# Altium project IOT Board.PrjPcb
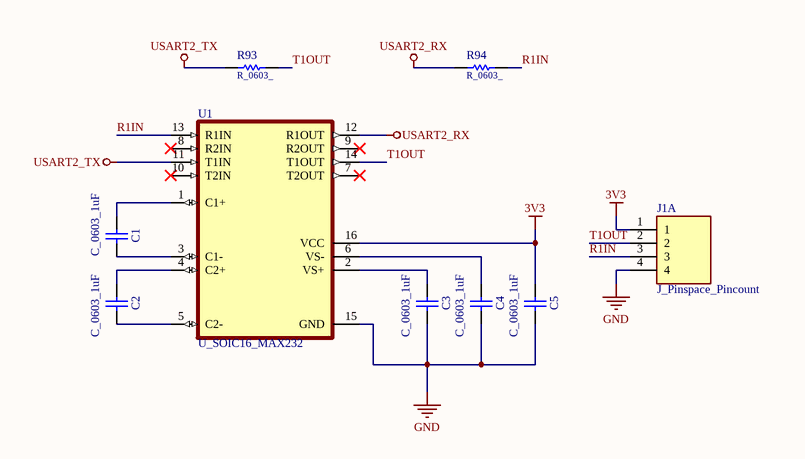
[diagram p0: Com.SchDoc]
7 sheets, 247 parts. Net scope: global (net labels, ports and power ports of the same name join across sheets).
Board file: IOT Board.PcbDoc
Sheets:
  Com.SchDoc
  ESP.SchDoc
  GSM.SchDoc
  MCU.SchDoc
  Motor.SchDoc
  Power.SchDoc
  Sensor.SchDoc

## Sheet Com.SchDoc
size A

### Parts
C1  C_0603_1uF  [CAP 0603]
C2  C_0603_1uF  [CAP 0603]
C3  C_0603_1uF  [CAP 0603]
C4  C_0603_1uF  [CAP 0603]
C5  C_0603_1uF  [CAP 0603]
J1  J_Pinspace_Pincount  [4 Pin PCB TB 3.81]  (part A of 2)
R93  R_0603_  [RES 0603]
R94  R_0603_  [RES 0603]
U1  U_SOIC16_MAX232  [SOIC16]

### Nets
3V3: C5.2 J1.1 U1.16(VCC)
GND: C3.1 C4.1 C5.1 J1.4 U1.15(GND)
USART2_RX: R94.2 U1.12(R1OUT)
USART2_TX: R93.2 U1.11(T1IN)
R1IN: J1.3 R94.1 U1.13(R1IN)
T1OUT: J1.2 R93.1 U1.14(T1OUT)
NetC1_1: C1.1 U1.3(C1-)
NetC1_2: C1.2 U1.1(C1+)
NetC2_1: C2.1 U1.5(C2-)
NetC2_2: C2.2 U1.4(C2+)
NetC3_2: C3.2 U1.2(VS+)
NetC4_2: C4.2 U1.6(VS-)

Not connected (* = marked no-connect by the designer): U1 7(T2OUT)* 8(R2IN)* 9(R2OUT)* 10(T2IN)*

### Library data of the parts
C1-C5 = Cap: Capacitor; Published: 8-Jun-2000; LatestRevisionDate: 17-Jul-2002; LatestRevisionNote: Re-released for DXP Platform.; Publisher: Altium Limited
J1 = 4 Pin PCB Terminal Block: MP: TBP02R1-381-04BE; Availability: Unavailable; Package: None; Price: None; Value: *
R93 R94 = Res: Resistor; Published: 8-Jun-2000; LatestRevisionDate: 17-Jul-2002; LatestRevisionNote: Re-released for DXP Platform.; Publisher: Altium Limited
U1 = MAX232DW: Dual EIA-232 driver and receiver 16-SOIC 0 to 70; MF: Texas Instruments; Price: None; SnapEDA_Link: https://www.snapeda.com/parts/MAX232DW/Texas%20Instruments/view-part/7702/?ref=snap; Purchase-URL: https://pricing.snapeda.com/search/part/MAX232DW/?ref=eda; Check_prices: https://www.snapeda.com/parts/MAX232DW/Texas%20Instruments/view-part/7702/?ref=eda; Value: *; MP: MAX232DW; Package: SOIC-16 Texas Instruments; Availability: Good

## Sheet ESP.SchDoc
size A
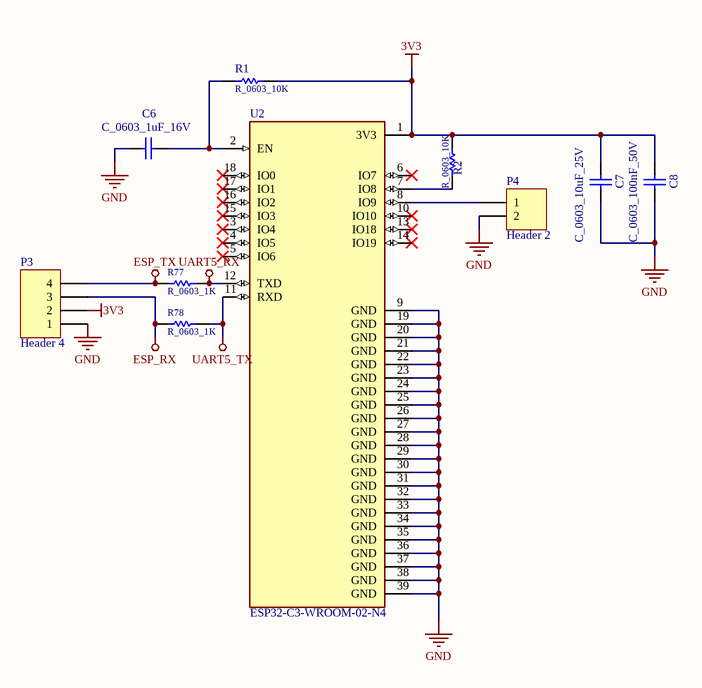
[diagram p1: ESP.SchDoc]

### Parts
C6  C_0603_1uF_16V  [CAP 0603]
C7  C_0603_10uF_25V  [CAP 0603]
C8  C_0603_100nF_50V  [CAP 0603]
P3  Header 4  [HDR1X4]
P4  Header 2  [HDR1X2]
R1  R_0603_10K  [RES 0603]
R2  R_0603_10K  [RES 0603]
R77  R_0603_1K  [RES 0603]
R78  R_0603_1K  [RES 0603]
U2  ESP32-C3-WROOM-02-N4  [ESP32-C3-WROOM-02-H4]

### Nets
3V3: C7.2 C8.2 P3.2 R1.1 R2.1 U2.1(3V3)
ESP_RX: P3.3 R78.2
ESP_TX: P3.4 R77.2
GND: C6.2 C7.1 C8.1 P3.1 P4.2 U2.9(GND) U2.19(GND) U2.20(GND) U2.21(GND) U2.22(GND) U2.23(GND) U2.24(GND) U2.25(GND) U2.26(GND) U2.27(GND) U2.28(GND) U2.29(GND) U2.30(GND) U2.31(GND) U2.32(GND) U2.33(GND) U2.34(GND) U2.35(GND) U2.36(GND) U2.37(GND) U2.38(GND) U2.39(GND)
UART5_RX: R77.1 U2.12(TXD)
UART5_TX: R78.1 U2.11(RXD)
NetC6_1: C6.1 R1.2 U2.2(EN)
NetP4_1: P4.1 U2.8(IO9)
NetR2_2: R2.2 U2.7(IO8)

Not connected (* = marked no-connect by the designer): U2 3(IO4)* 4(IO5)* 5(IO6)* 6(IO7)* 10(IO10)* 13(IO18)* 14(IO19)* 15(IO3)* 16(IO2)* 17(IO1)* 18(IO0)*

### Library data of the parts
C6-C8 = Cap: Capacitor; Published: 8-Jun-2000; LatestRevisionDate: 17-Jul-2002; LatestRevisionNote: Re-released for DXP Platform.; Publisher: Altium Limited
P3 = Header 4: Header, 4-Pin; LatestRevisionDate: 17-Jul-2002; LatestRevisionNote: Re-released for DXP Platform.; Publisher: Altium Limited
P4 = Header 2: Header, 2-Pin; LatestRevisionDate: 17-Jul-2002; LatestRevisionNote: Re-released for DXP Platform.; Publisher: Altium Limited
R1 R2 R77 R78 = Res: Resistor; Published: 8-Jun-2000; LatestRevisionDate: 17-Jul-2002; LatestRevisionNote: Re-released for DXP Platform.; Publisher: Altium Limited
U2 = ESP32-C3-WROOM-02-N4: WiFi Modules (802.11) (Engineering Samples) SMD module, ESP32-C3, 4MB SPI flash, PCB antenna, -40 C +85 C; MF: Espressif Systems; Value: *; SnapEDA_Link: https://www.snapeda.com/parts/ESP32-C3-WROOM-02-N4/Espressif+Systems/view-part/?ref=snap; Purchase-URL: https://pricing.snapeda.com/search/part/ESP32-C3-WROOM-02-N4/?ref=eda; Availability: In Stock; Price: None; Package: Package; Check_prices: https://www.snapeda.com/parts/ESP32-C3-WROOM-02-N4/Espressif+Systems/view-part/?ref=eda; MP: ESP32-C3-WROOM-02-N4

## Sheet GSM.SchDoc
size A3
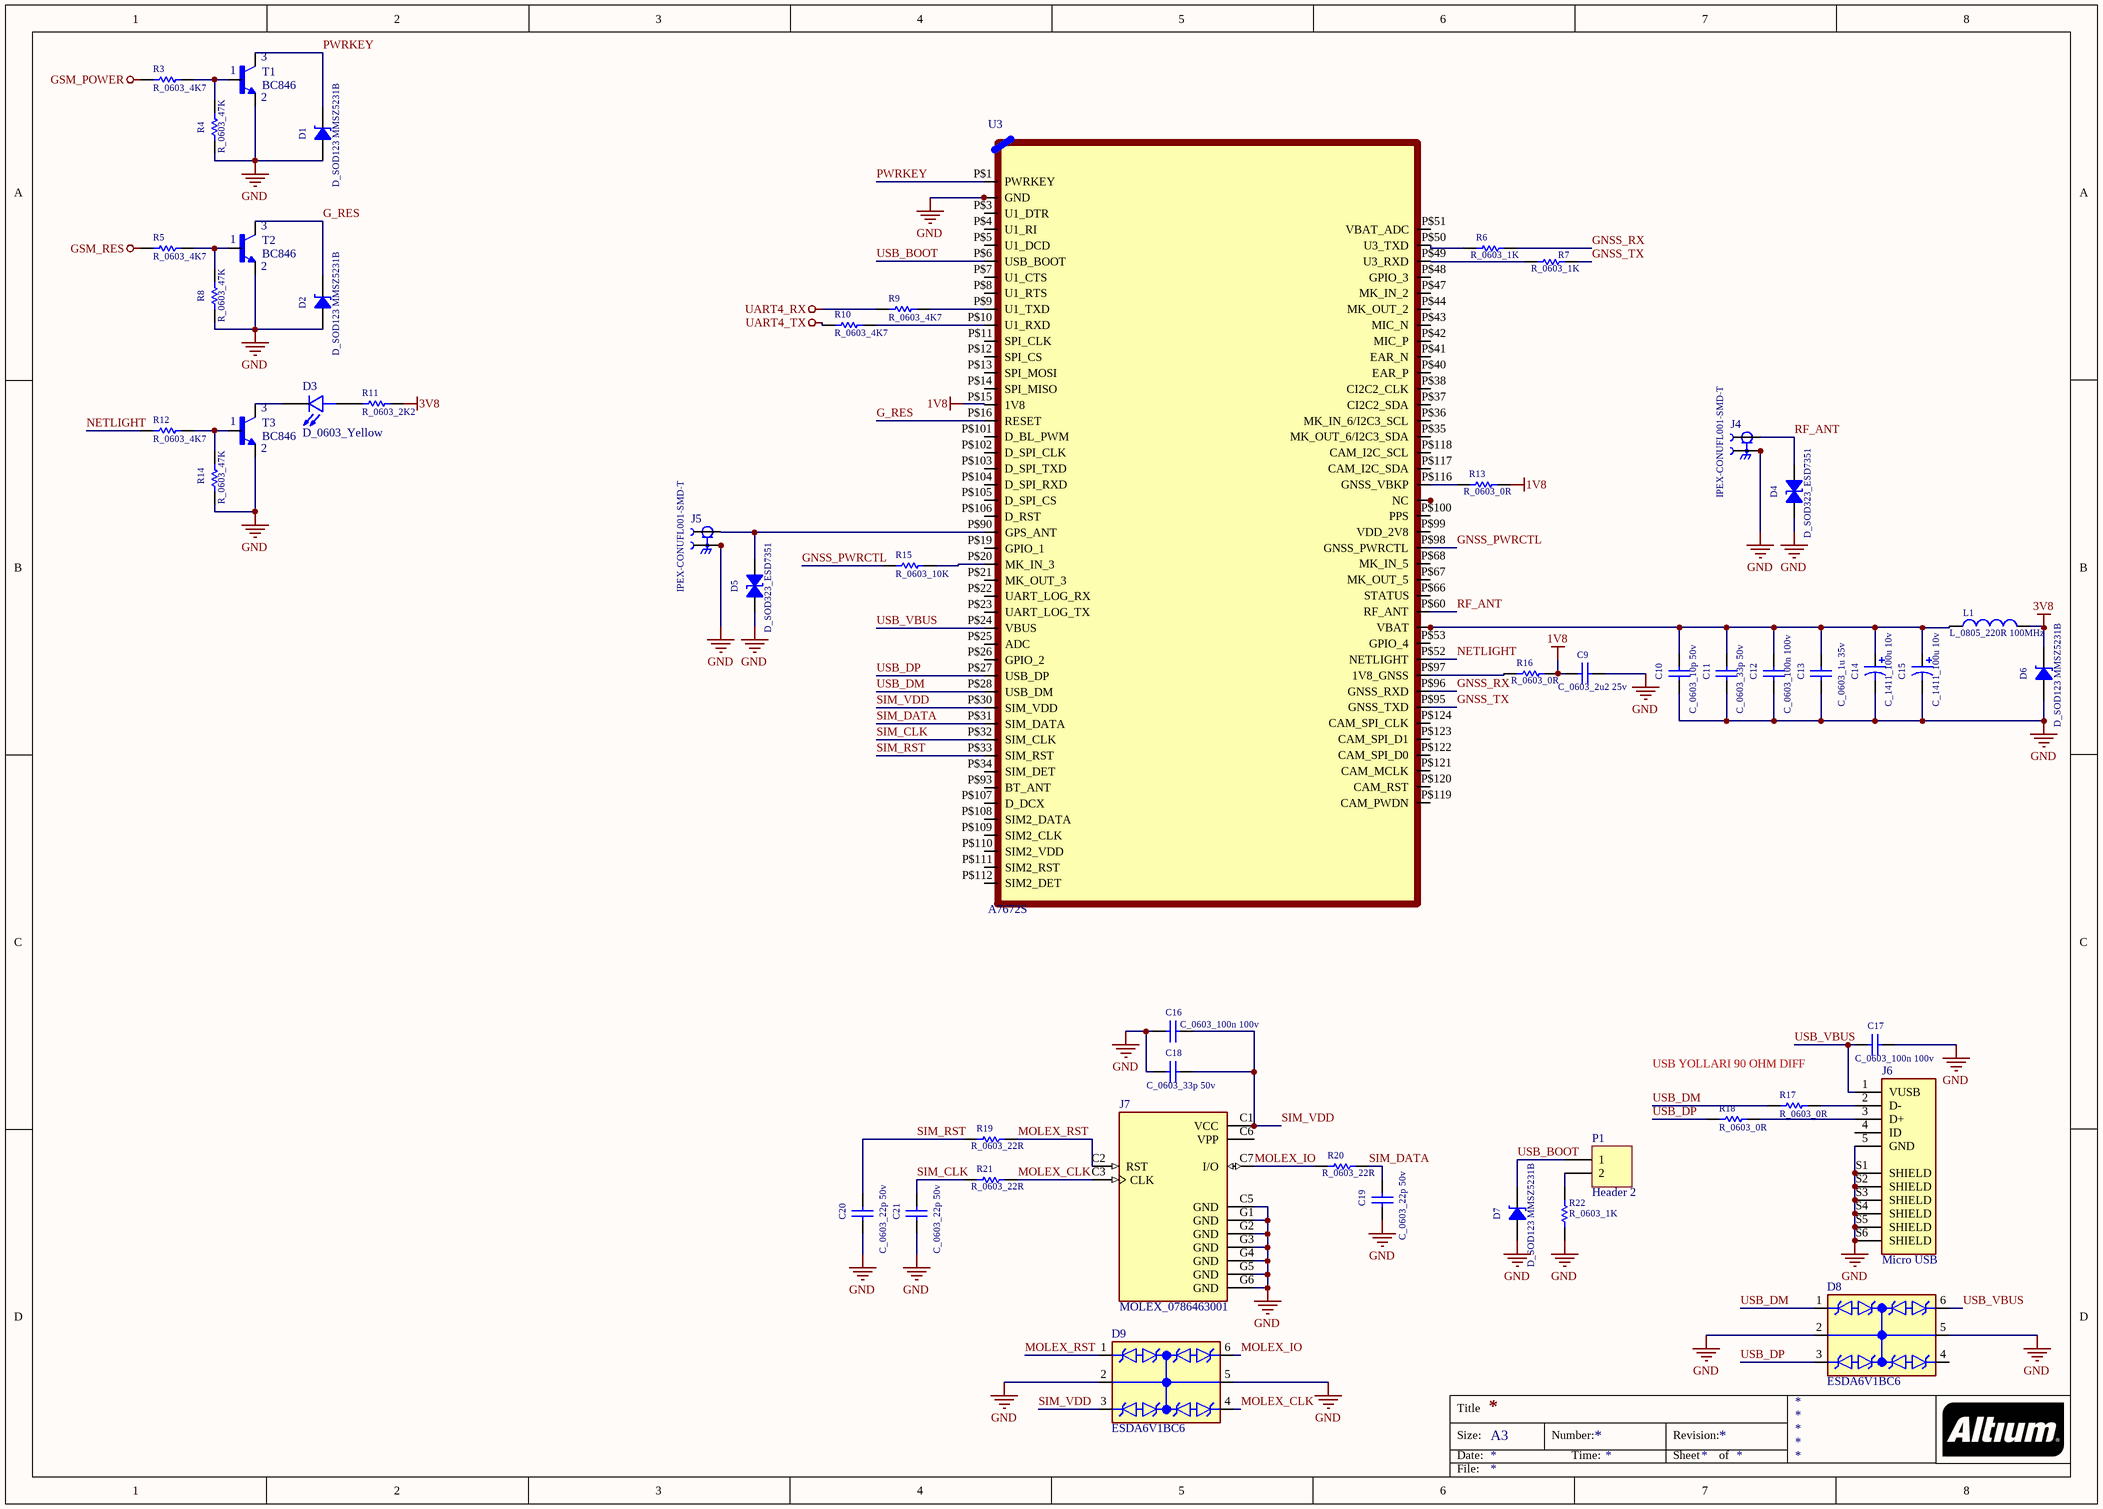
[diagram p2: GSM.SchDoc]

### Parts
C9  C_0603_2u2 25v  [CAP 0603]
C10  C_0603_10p 50v  [CAP 0603]
C11  C_0603_33p 50v  [CAP 0603]
C12  C_0603_100n 100v  [CAP 0603]
C13  C_0603_1u 35v  [CAP 0603]
C14  C_1411_100u 10v  [CAP 1411 TAN]
C15  C_1411_100u 10v  [CAP 1411 TAN]
C16  C_0603_100n 100v  [CAP 0603]
C17  C_0603_100n 100v  [CAP 0603]
C18  C_0603_33p 50v  [CAP 0603]
C19  C_0603_22p 50v  [CAP 0603]
C20  C_0603_22p 50v  [CAP 0603]
C21  C_0603_22p 50v  [CAP 0603]
D1  D_SOD123 MMSZ5231B  [SOD-123]
D2  D_SOD123 MMSZ5231B  [SOD-123]
D3  D_0603_Yellow  [Led 0603]
D4  D_SOD323_ESD7351  [SOD323]
D5  D_SOD323_ESD7351  [SOD323]
D6  D_SOD123 MMSZ5231B  [SOD-123]
D7  D_SOD123 MMSZ5231B  [SOD-123]
D8  ESDA6V1BC6  [SOT23-6]
D9  ESDA6V1BC6  [SOT23-6]
J4  IPEX-CONUFL001-SMD-T  [IPEX_LINX_CONUFL001-SMD-T]
J5  IPEX-CONUFL001-SMD-T  [IPEX_LINX_CONUFL001-SMD-T]
J6  Micro USB  [Micro USB]
J7  MOLEX_0786463001  [MOLEX_0786463001]
L1  L_0805_220R 100MHz  [Inductor 0805]
P1  Header 2  [HDR1X2]
R3  R_0603_4K7  [RES 0603]
R4  R_0603_47K  [RES 0603]
R5  R_0603_4K7  [RES 0603]
R6  R_0603_1K  [RES 0603]
R7  R_0603_1K  [RES 0603]
R8  R_0603_47K  [RES 0603]
R9  R_0603_4K7  [RES 0603]
R10  R_0603_4K7  [RES 0603]
R11  R_0603_2K2  [RES 0603]
R12  R_0603_4K7  [RES 0603]
R13  R_0603_0R  [RES 0603]
R14  R_0603_47K  [RES 0603]
R15  R_0603_10K  [RES 0603]
R16  R_0603_0R  [RES 0603]
R17  R_0603_0R  [RES 0603]
R18  R_0603_0R  [RES 0603]
R19  R_0603_22R  [RES 0603]
R20  R_0603_22R  [RES 0603]
R21  R_0603_22R  [RES 0603]
R22  R_0603_1K  [RES 0603]
T1  BC846  [SOT23]
T2  BC846  [SOT23]
T3  BC846  [SOT23]
U3  A7672S  [A7672S]

### Nets
1V8: C9.1 R13.1 R16.1 U3.P$15(1V8)
3V8: D6.2 L1.2 R11.2
GND: C9.2 C10.1 C11.1 C12.1 C13.2 C14.2 C15.2 C16.2 C17.1 C18.2 C19.2 C20.2 C21.2 D1.1 D2.1 D4.1 D5.1 D6.1 D7.1 D8.2(CC1) D8.5(CC2) D9.2(CC1) D9.5(CC2) J4.2 J4.3 J5.2 J5.3 J6.5(GND) J6.S1(SHIELD) J6.S2(SHIELD) J6.S3(SHIELD) J6.S4(SHIELD) J6.S5(SHIELD) J6.S6(SHIELD) J7.C5(GND) J7.G1(GND) J7.G2(GND) J7.G3(GND) J7.G4(GND) J7.G5(GND) J7.G6(GND) R4.2 R8.2 R14.2 R22.2 T1.2(E) T2.2(E) T3.2(E) U3.P$2(GND) U3.P$17(GND) U3.P$18(GND) U3.P$29(GND) U3.P$39(GND) U3.P$45(GND) U3.P$46(GND) U3.P$54(GND) U3.P$58(GND) U3.P$59(GND) U3.P$61(GND) U3.P$62(GND) U3.P$63(GND) U3.P$64(GND) U3.P$65(GND) U3.P$69(GND) U3.P$70(GND) U3.P$71(GND) U3.P$72(GND) U3.P$73(GND) U3.P$74(GND) U3.P$75(GND) U3.P$76(GND) U3.P$77(GND) U3.P$78(GND) U3.P$79(GND) U3.P$80(GND) U3.P$81(GND) U3.P$82(GND) U3.P$83(GND) U3.P$84(GND) U3.P$85(GND) U3.P$86(GND) U3.P$87(GND) U3.P$88(GND) U3.P$89(GND) U3.P$91(GND) U3.P$92(GND) U3.P$94(GND)
GSM_POWER: R3.2
GSM_RES: R5.2
UART4_RX: R9.2
UART4_TX: R10.2
G_RES: D2.2 T2.3(C) U3.P$16(RESET)
GNSS_PWRCTL: R15.2 U3.P$98(GNSS_PWRCTL)
GNSS_RX: R6.1 U3.P$96(GNSS_RXD)
GNSS_TX: R7.1 U3.P$95(GNSS_TXD)
MOLEX_CLK: D9.4(C3) J7.C3(CLK) R21.1
MOLEX_IO: D9.6(C4) J7.C7(I/O) R20.2
MOLEX_RST: D9.1(C1) J7.C2(RST) R19.1
NETLIGHT: R12.2 U3.P$52(NETLIGHT)
PWRKEY: D1.2 T1.3(C) U3.P$1(PWRKEY)
RF_ANT: D4.2 J4.1 U3.P$60(RF_ANT)
SIM_CLK: C21.1 R21.2 U3.P$32(SIM_CLK)
SIM_DATA: C19.1 R20.1 U3.P$31(SIM_DATA)
SIM_RST: C20.1 R19.2 U3.P$33(SIM_RST)
SIM_VDD: C16.1 C18.1 D9.3(C2) J7.C1(VCC) U3.P$30(SIM_VDD)
USB_BOOT: D7.2 P1.1 U3.P$6(USB_BOOT)
USB_DM: D8.1(C1) R17.2 U3.P$28(USB_DM)
USB_DP: D8.3(C2) R18.2 U3.P$27(USB_DP)
USB_VBUS: C17.2 D8.6(C4) J6.1(VUSB) U3.P$24(VBUS)
NetC10_2: C10.2 C11.2 C12.2 C13.1 C14.1 C15.1 L1.1 U3.P$55(VBAT) U3.P$56(VBAT) U3.P$57(VBAT)
NetD3_1: D3.1(A) R11.1
NetD3_2: D3.2(C) T3.3(C)
NetD5_2: D5.2 J5.1 U3.P$90(GPS_ANT)
NetJ6_2: J6.2(D-) R17.1
NetJ6_3: J6.3(D+) R18.1
NetP1_2: P1.2 R22.1
NetR3_1: R3.1 R4.1 T1.1(B)
NetR5_1: R5.1 R8.1 T2.1(B)
NetR6_2: R6.2 U3.P$50(U3_TXD)
NetR7_2: R7.2 U3.P$49(U3_RXD)
NetR9_1: R9.1 U3.P$9(U1_TXD)
NetR10_1: R10.1 U3.P$10(U1_RXD)
NetR12_1: R12.1 R14.1 T3.1(B)
NetR13_2: R13.2 U3.P$116(GNSS_VBKP)
NetR15_1: R15.1 U3.P$20(MK_IN_3)
NetR16_2: R16.2 U3.P$97(1V8_GNSS)
NetU3_P$113: U3.P$113(NC) U3.P$114(NC) U3.P$115(NC)

Not connected (* = marked no-connect by the designer): D8 4(C3); J6 4(ID); J7 C6(VPP); U3 P$3(U1_DTR) P$4(U1_RI) P$5(U1_DCD) P$7(U1_CTS) P$8(U1_RTS) P$11(SPI_CLK) P$12(SPI_CS) P$13(SPI_MOSI) P$14(SPI_MISO) P$19(GPIO_1) P$21(MK_OUT_3) P$22(UART_LOG_RX) P$23(UART_LOG_TX) P$25(ADC) P$26(GPIO_2) P$34(SIM_DET) P$35(MK_OUT_6/I2C3_SDA) P$36(MK_IN_6/I2C3_SCL) P$37(CI2C2_SDA) P$38(CI2C2_CLK) P$40(EAR_P) P$41(EAR_N) P$42(MIC_P) P$43(MIC_N) P$44(MK_OUT_2) P$47(MK_IN_2) P$48(GPIO_3) P$51(VBAT_ADC) P$53(GPIO_4) P$66(STATUS) P$67(MK_OUT_5) P$68(MK_IN_5) P$93(BT_ANT) P$99(VDD_2V8) P$100(PPS) P$101(D_BL_PWM) P$102(D_SPI_CLK) P$103(D_SPI_TXD) P$104(D_SPI_RXD) P$105(D_SPI_CS) P$106(D_RST) P$107(D_DCX) P$108(SIM2_DATA) P$109(SIM2_CLK) P$110(SIM2_VDD) P$111(SIM2_RST) P$112(SIM2_DET) P$117(CAM_I2C_SDA) P$118(CAM_I2C_SCL) P$119(CAM_PWDN) P$120(CAM_RST) P$121(CAM_MCLK) P$122(CAM_SPI_D0) P$123(CAM_SPI_D1) P$124(CAM_SPI_CLK)

### Notes on the sheet
- USB YOLLARI 90 OHM DIFF
- Title
- Size:
- Date:
- A3
- Number:
- Time:
- Revision:
- Sheet
- of
- File:

### Library data of the parts
C9-C13 C16-C21 = Cap: Capacitor; Published: 8-Jun-2000; LatestRevisionDate: 17-Jul-2002; LatestRevisionNote: Re-released for DXP Platform.; Publisher: Altium Limited
C14 C15 = Cap Tantalium: Capacitor Tantalium; Published: 8-Jun-2000; LatestRevisionDate: 17-Jul-2002; LatestRevisionNote: Re-released for DXP Platform.; Publisher: Altium Limited
D1 D2 D6 D7 = Diode Zener: Zener Diode
D3 = Led: MP: SML-D12FWT86; MF: Rohm; Price: None; Availability: In Stock; Package: 0603 Rohm; SnapEDA_Link: https://www.snapeda.com/parts/SML-D12FWT86/Rohm/view-part/?ref=snap; Check_prices: https://www.snapeda.com/parts/SML-D12FWT86/Rohm/view-part/?ref=eda; Value: *; Purchase-URL: https://pricing.snapeda.com/search/part/SML-D12FWT86/?ref=eda
D4 D5 = Diode TVS: Zener Diode
D8 D9 = ESDA6V1BC6: - Clamp - Ipp Tvs Diode Surface Mount SOT-23-6; MF: STMicroelectronics; Check_prices: https://www.snapeda.com/parts/ESDA6V1BC6/STMicroelectronics/view-part/?ref=eda; Price: None; MP: ESDA6V1BC6; Purchase-URL: https://pricing.snapeda.com/search/part/ESDA6V1BC6/?ref=eda; SnapEDA_Link: https://www.snapeda.com/parts/ESDA6V1BC6/STMicroelectronics/view-part/?ref=snap; Availability: In Stock; Package: SOT-23-6 STMicroelectronics; Value: *
J4 J5 = IPEX-CONUFL001-SMD-T: U.FL (UMCC) Connector Jack, Male Pin 50Ohm Surface Mount Solder; MF: Linx; Price: None; MP: CONUFL001-SMD-T; Package: None; Value: *; Check_prices: https://www.snapeda.com/parts/CONUFL001-SMD-T/Linx/view-part/?ref=eda; Availability: Unavailable; SnapEDA_Link: https://www.snapeda.com/parts/CONUFL001-SMD-T/Linx/view-part/?ref=snap
J6 = Micro USB: Micro USB 2.0, Input Output Connectors, B TYPE RECEPTACLE; MP: 10118193-0001LF; MF: Amphenol ICC; Value: *; Package: None; Check_prices: https://www.snapeda.com/parts/10118193-0001LF/Amphenol+FCI/view-part/?ref=eda; Purchase-URL: https://pricing.snapeda.com/search/part/10118193-0001LF/?ref=eda; Price: None; Availability: In Stock; SnapEDA_Link: https://www.snapeda.com/parts/10118193-0001LF/Amphenol+FCI/view-part/?ref=snap
J7 = MOLEX_0786463001: 6 Position Card Connector Micro SIM Surface Mount, Right Angle Gold; MF: Molex; Check_prices: https://www.snapeda.com/parts/0786463001/Molex/view-part/?ref=eda; SnapEDA_Link: https://www.snapeda.com/parts/0786463001/Molex/view-part/?ref=snap; Value: *; Purchase-URL: https://pricing.snapeda.com/search/part/0786463001/?ref=eda; Availability: In Stock; Price: None; MP: 0786463001; Package: None
L1 = Inductor: PCB_Layout: Complies with manufacturer's recommendation.; Published: 26-Sep-2008; DatasheetVersion: Mar-2008; PackageVersion: Mar-2008; PackageReference: B82462G4; Publisher: Altium Limited; PackageDescription: SM Power Inductor; 2 Leads; Body 6.3 x 6.3 x 3.0 mm (LxWxH); ComponentLink1Description: Manufacturer Link; ComponentLink1URL: http://www.epcos.com/; ComponentLink2Description: Datasheet; ComponentLink2URL: http://www.epcos.com/inf/30/db/ind_2008/b82462g4.pdf
P1 = Header 2: Header, 2-Pin; LatestRevisionDate: 17-Jul-2002; LatestRevisionNote: Re-released for DXP Platform.; Publisher: Altium Limited
R3-R22 = Res: Resistor; Published: 8-Jun-2000; LatestRevisionDate: 17-Jul-2002; LatestRevisionNote: Re-released for DXP Platform.; Publisher: Altium Limited
T1-T3 = BC846: TRANSISTOR, NPN, 0.1A, 65V, SOT23; Transistor Polarity:NPN; Collector Emitter Voltage V(br)ceo:65V; Transition Frequency Typ ft:100MHz; Power Dissipation Pd:250mW; DC Collector Current:100mA; DC Current Gain hFE:110; Operating Temperature Min:-55Â°C; Operating Temperature Max:150Â°C; Transistor Case Style:SOT-23; No. of Pins:3; DC Current Gain Hfe Max:450; Operating Temperature Range:-55Â°C to +150Â°C; MF: ON Semiconductor; MP: BC846; Value: *; SnapEDA_Link: https://www.snapeda.com/parts/BC846/Onsemi/view-part/?ref=snap; Availability: In Stock; Purchase-URL: https://pricing.snapeda.com/search/part/BC846/?ref=eda; Package: SOT-23-3 Panasonic Electronic; Price: None; Check_prices: https://www.snapeda.com/parts/BC846/Onsemi/view-part/?ref=eda
U3 = A7672S: LTE Cat 1 Module On Module 10Mbps 700MHz/800MHz/900MHz/1700MHz/1800MHz/1900MHz/2100MHz 33dBm 3.4V to 4.2V -109dBm; MF: SIMCom; Check_prices: https://www.snapeda.com/parts/A7672S/SIMCom/view-part/?ref=eda; Value: *; Availability: Not in stock; Price: None; Package: Package; MP: A7672S; SnapEDA_Link: https://www.snapeda.com/parts/A7672S/SIMCom/view-part/?ref=snap

## Sheet MCU.SchDoc
size A4
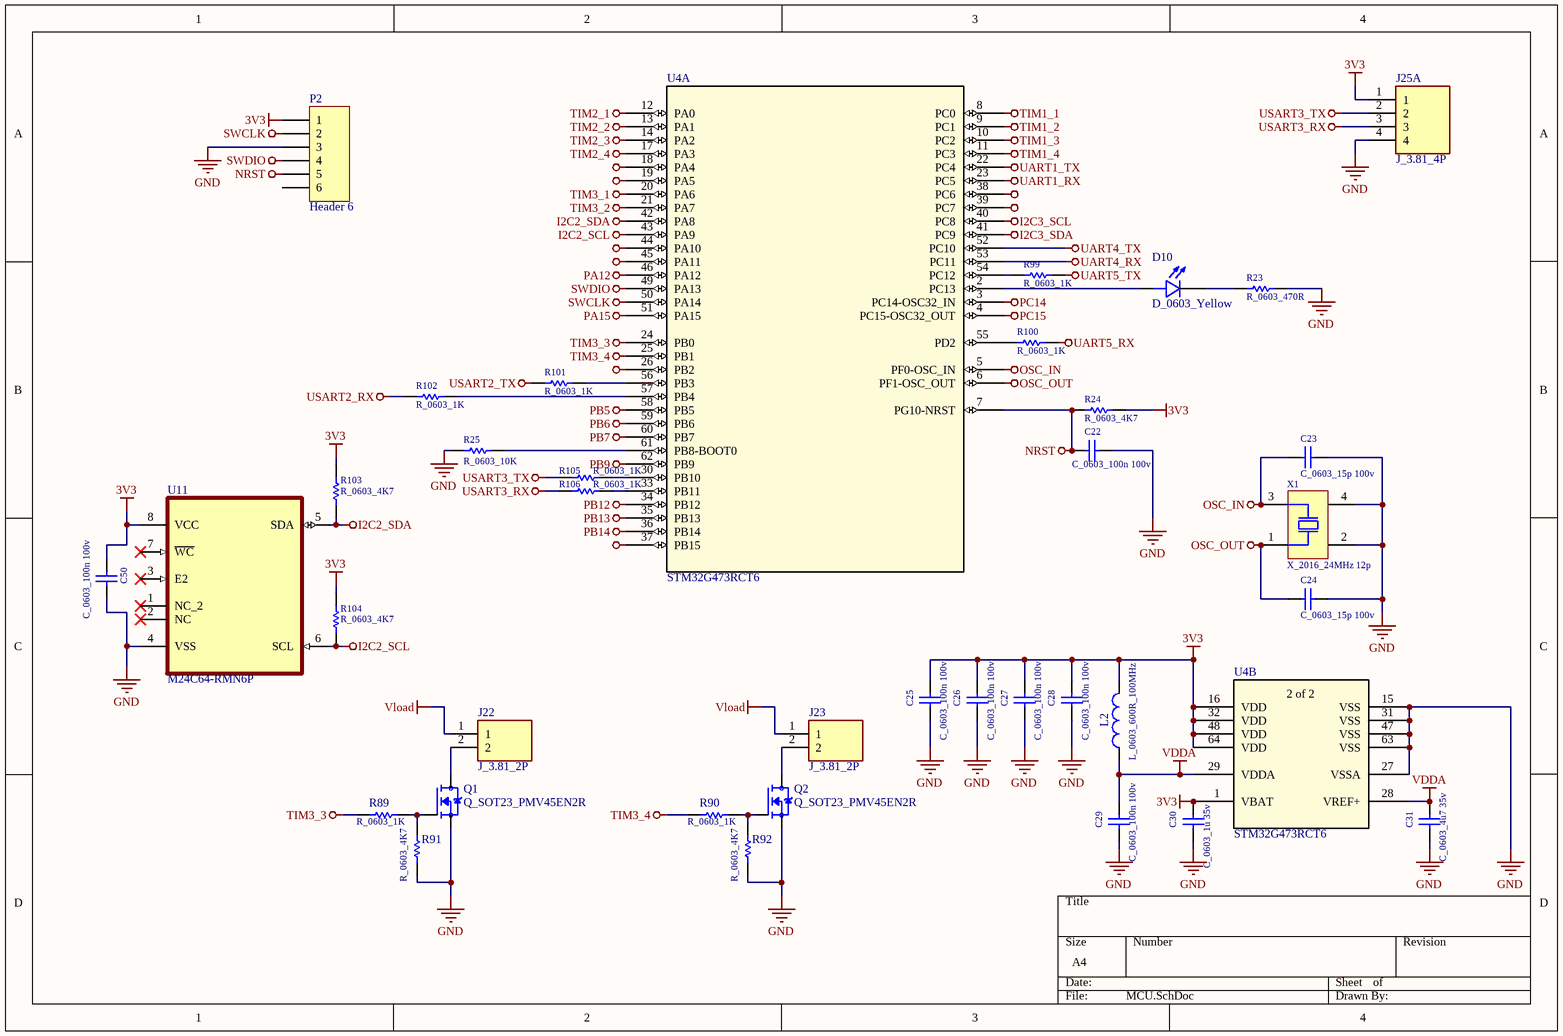
[diagram p3: MCU.SchDoc]

### Parts
C22  C_0603_100n 100v  [CAP 0603]
C23  C_0603_15p 100v  [CAP 0603]
C24  C_0603_15p 100v  [CAP 0603]
C25  C_0603_100n 100v  [CAP 0603]
C26  C_0603_100n 100v  [CAP 0603]
C27  C_0603_100n 100v  [CAP 0603]
C28  C_0603_100n 100v  [CAP 0603]
C29  C_0603_100n 100v  [CAP 0603]
C30  C_0603_1u 35v  [CAP 0603]
C31  C_0603_4u7 35v  [CAP 0603]
C50  C_0603_100n 100v  [CAP 0603]
D10  D_0603_Yellow  [Led 0603]
J22  J_3.81_2P  [2 Pin PCB TB 3.81]
J23  J_3.81_2P  [2 Pin PCB TB 3.81]
J25  J_3.81_4P  [4 Pin PCB TB 3.81]  (part A of 2)
L2  L_0603_600R_100MHz  [Inductor 0603]
P2  Header 6  [HDR1X6]
Q1  Q_SOT23_PMV45EN2R  [SOT23]
Q2  Q_SOT23_PMV45EN2R  [SOT23]
R23  R_0603_470R  [RES 0603]
R24  R_0603_4K7  [RES 0603]
R25  R_0603_10K  [RES 0603]
R89  R_0603_1K  [RES 0603]
R90  R_0603_1K  [RES 0603]
R91  R_0603_4K7  [RES 0603]
R92  R_0603_4K7  [RES 0603]
R99  R_0603_1K  [RES 0603]
R100  R_0603_1K  [RES 0603]
R101  R_0603_1K  [RES 0603]
R102  R_0603_1K  [RES 0603]
R103  R_0603_4K7  [RES 0603]
R104  R_0603_4K7  [RES 0603]
R105  R_0603_1K  [RES 0603]
R106  R_0603_1K  [RES 0603]
U4  STM32G473RCT6  [LQFP64]  (parts A,B of 2)
U11  M24C64-RMN6P  [SOIC8 - NO-EXP]
X1  X_2016_24MHz 12p  [Crystal 2016]

### Nets
3V3: C25.2 C26.2 C27.2 C28.2 C30.1 C50.1 J25.1 L2.2 P2.1 R24.1 R103.2 R104.2 U4.1(VBAT) U4.16(VDD) U4.32(VDD) U4.48(VDD) U4.64(VDD) U11.8(VCC)
GND: C22.1 C23.1 C24.1 C25.1 C26.1 C27.1 C28.1 C29.2 C30.2 C31.2 C50.2 J25.4 P2.3 Q1.2(S) Q2.2(S) R23.1 R25.1 R91.1 R92.1 U4.15(VSS) U4.27(VSSA) U4.31(VSS) U4.47(VSS) U4.63(VSS) U11.4(VSS) X1.2(NC) X1.4(NC)
I2C2_SCL: R104.1 U4.43(PA9) U11.6(SCL)
I2C2_SDA: R103.1 U4.42(PA8) U11.5(SDA)
I2C3_SCL: U4.40(PC8)
I2C3_SDA: U4.41(PC9)
NetU4_18: U4.18(PA4) U4.19(PA5) U4.26(PB2) U4.37(PB15) U4.38(PC6) U4.39(PC7) U4.44(PA10) U4.45(PA11)
NRST: C22.2 P2.5 R24.2 U4.7(PG10-NRST)
OSC_IN: C23.2 U4.5(PF0-OSC_IN) X1.3(OSC2)
OSC_OUT: C24.2 U4.6(PF1-OSC_OUT) X1.1(OSC1)
PA12: U4.46(PA12)
PA15: U4.51(PA15)
PB5: U4.58(PB5)
PB6: U4.59(PB6)
PB7: U4.60(PB7)
PB9: U4.62(PB9)
PB12: U4.34(PB12)
PB13: U4.35(PB13)
PB14: U4.36(PB14)
PC14: U4.3(PC14-OSC32_IN)
PC15: U4.4(PC15-OSC32_OUT)
SWCLK: P2.2 U4.50(PA14)
SWDIO: P2.4 U4.49(PA13)
TIM1_1: U4.8(PC0)
TIM1_2: U4.9(PC1)
TIM1_3: U4.10(PC2)
TIM1_4: U4.11(PC3)
TIM2_1: U4.12(PA0)
TIM2_2: U4.13(PA1)
TIM2_3: U4.14(PA2)
TIM2_4: U4.17(PA3)
TIM3_1: U4.20(PA6)
TIM3_2: U4.21(PA7)
TIM3_3: R89.2 U4.24(PB0)
TIM3_4: R90.2 U4.25(PB1)
UART1_RX: U4.23(PC5)
UART1_TX: U4.22(PC4)
UART4_RX: U4.53(PC11)
UART4_TX: U4.52(PC10)
UART5_RX: R100.1
UART5_TX: R99.1
USART2_RX: R102.2
USART2_TX: R101.2
USART3_RX: J25.3 R106.1
USART3_TX: J25.2 R105.1
VDDA: C29.1 C31.1 L2.1 U4.28(VREF+) U4.29(VDDA)
Vload: J22.1 J23.1
NetD10_1: D10.1(A) U4.2(PC13)
NetD10_2: D10.2(C) R23.2
NetJ22_2: J22.2 Q1.3(D)
NetJ23_2: J23.2 Q2.3(D)
NetQ1_1: Q1.1(G) R89.1 R91.2
NetQ2_1: Q2.1(G) R90.1 R92.2
NetR25_2: R25.2 U4.61(PB8-BOOT0)
NetR99_2: R99.2 U4.54(PC12)
NetR100_2: R100.2 U4.55(PD2)
NetR101_1: R101.1 U4.56(PB3)
NetR102_1: R102.1 U4.57(PB4)
NetR105_2: R105.2 U4.30(PB10)
NetR106_2: R106.2 U4.33(PB11)

Not connected (* = marked no-connect by the designer): P2 6; U11 1(NC_2)* 2(NC)* 3(E2)* 7(~{WC})*

### Notes on the sheet
- (in symbol STM32G473RCT6, part B) 2 of 2

### Library data of the parts
C22-C31 C50 = Cap: Capacitor; Published: 8-Jun-2000; LatestRevisionDate: 17-Jul-2002; LatestRevisionNote: Re-released for DXP Platform.; Publisher: Altium Limited
D10 = Led: MP: SML-D12FWT86; MF: Rohm; Price: None; Availability: In Stock; Package: 0603 Rohm; SnapEDA_Link: https://www.snapeda.com/parts/SML-D12FWT86/Rohm/view-part/?ref=snap; Check_prices: https://www.snapeda.com/parts/SML-D12FWT86/Rohm/view-part/?ref=eda; Value: *; Purchase-URL: https://pricing.snapeda.com/search/part/SML-D12FWT86/?ref=eda
J22 J23 = 2 Pin PCB Terminal Block: MF: CUI Devices; MP: TBP02R1-381-02BE; CUI_purchase_URL: https://www.cuidevices.com/product/interconnect/connectors/terminal-blocks/tbp02r1-381-series?utm_source=snapeda.com&utm_medium=referral&utm_campaign=snapedaBOM; Purchase-URL: https://pricing.snapeda.com/search/part/TBP02R1-381-02BE/?ref=eda; Price: None; SnapEDA_Link: https://www.snapeda.com/parts/TBP02R1-381-02BE/CUI+Devices/view-part/?ref=snap; Check_prices: https://www.snapeda.com/parts/TBP02R1-381-02BE/CUI+Devices/view-part/?ref=eda; Package: None; Availability: In Stock; Value: *
J25 = 4 Pin PCB Terminal Block: MP: TBP02R1-381-04BE; Availability: Unavailable; Package: None; Price: None; Value: *
L2 = Inductor: as L1 on sheet GSM; Published: 26-Sep-2008; DatasheetVersion: Mar-2008; PackageVersion: Mar-2008; PackageReference: B82462G4; Publisher: Altium Limited; PackageDescription: SM Power Inductor; 2 Leads; Body 6.3 x 6.3 x 3.0 mm (LxWxH); ComponentLink1Description: Manufacturer Link; ComponentLink1URL: http://www.epcos.com/; ComponentLink2Description: Datasheet; ComponentLink2URL: http://www.epcos.com/inf/30/db/ind_2008/b82462g4.pdf
P2 = Header 6: Header, 6-Pin; LatestRevisionDate: 17-Jul-2002; LatestRevisionNote: Re-released for DXP Platform.; Publisher: Altium Limited
Q1 Q2 = N Channel Mosfet: RoHS Compliant | Low RDS(on) | Industry-leading quality | Dynamic dv/dt Rating | Fast Switching | Fully Avalanche Rated | 175C Operating Temperature | Logic Level; MP: IRLR2705PBF; MF: Infineon Technologies; Check_prices: https://www.snapeda.com/parts/IRLR2705PBF/Infineon+Technologies/view-part/?ref=eda; Value: *; Availability: In Stock; Price: None; Package: TO-252 Infineon; SnapEDA_Link: https://www.snapeda.com/parts/IRLR2705PBF/Infineon+Technologies/view-part/?ref=snap; Purchase-URL: https://pricing.snapeda.com/search/part/IRLR2705PBF/?ref=eda
R23-R25 R89-R92 R99-R106 = Res: Resistor; Published: 8-Jun-2000; LatestRevisionDate: 17-Jul-2002; LatestRevisionNote: Re-released for DXP Platform.; Publisher: Altium Limited
U4 = STM32G473RCT6: No Description Available; Mfr_Name: STMicroelectronics; RefDes: RefDes; Type: Type
U11 = M24C64-RMN6P: EEPROM; Package: None; Price: None; Value: *; MP: M24C64-RMN6P; Availability: Unavailable
X1 = Crystal 4 Pin

## Sheet Motor.SchDoc
size A
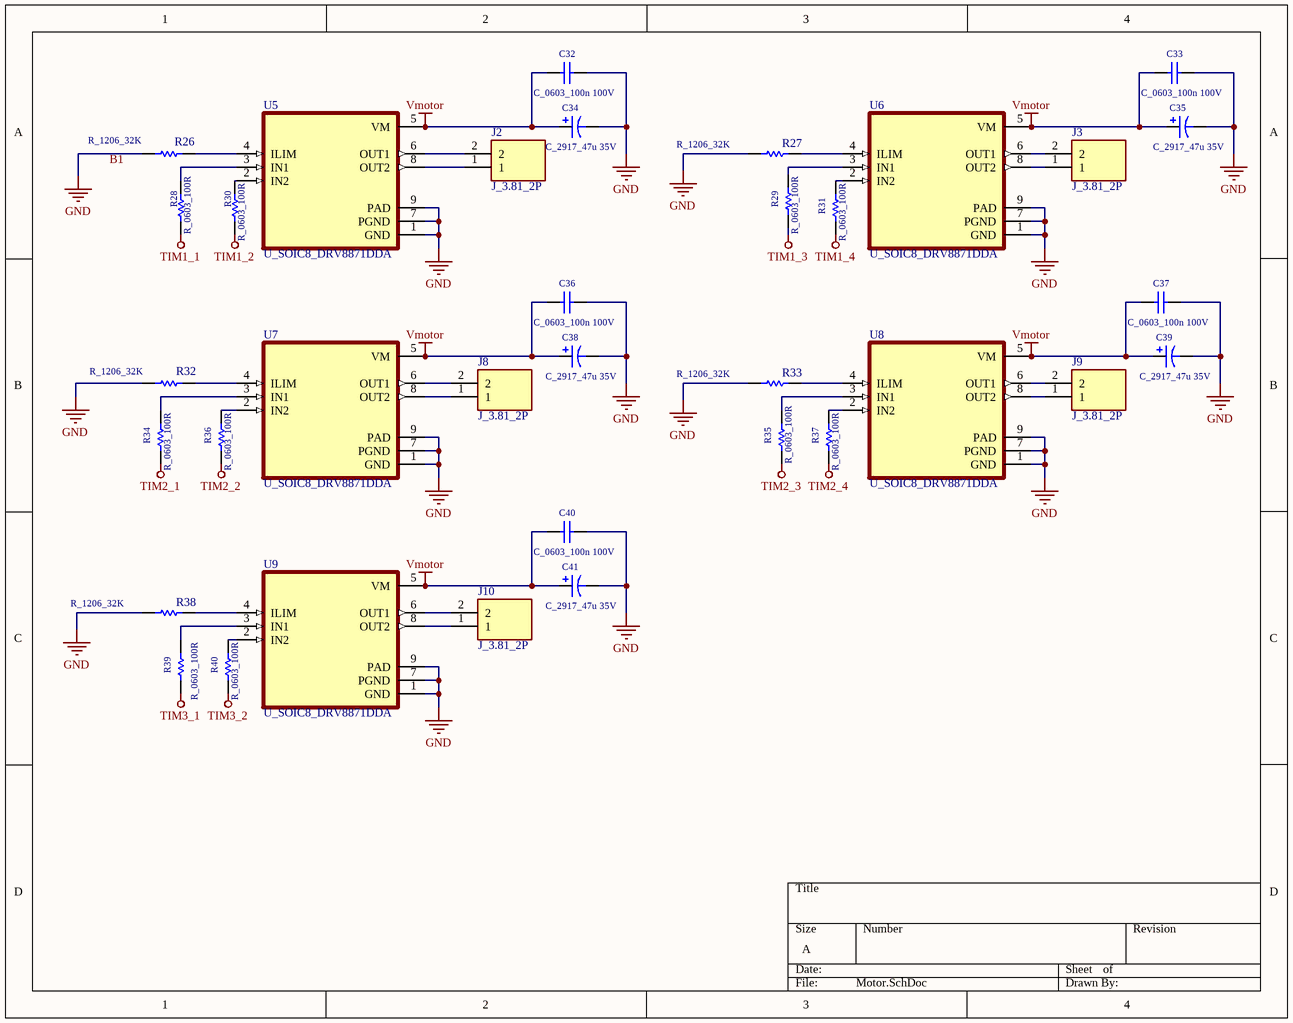
[diagram p4: Motor.SchDoc]

### Parts
C32  C_0603_100n 100V  [CAP 0603]
C33  C_0603_100n 100V  [CAP 0603]
C34  C_2917_47u 35V  [CAP 2917 TAN]
C35  C_2917_47u 35V  [CAP 2917 TAN]
C36  C_0603_100n 100V  [CAP 0603]
C37  C_0603_100n 100V  [CAP 0603]
C38  C_2917_47u 35V  [CAP 2917 TAN]
C39  C_2917_47u 35V  [CAP 2917 TAN]
C40  C_0603_100n 100V  [CAP 0603]
C41  C_2917_47u 35V  [CAP 2917 TAN]
J2  J_3.81_2P  [2 Pin PCB TB 3.81]
J3  J_3.81_2P  [2 Pin PCB TB 3.81]
J8  J_3.81_2P  [2 Pin PCB TB 3.81]
J9  J_3.81_2P  [2 Pin PCB TB 3.81]
J10  J_3.81_2P  [2 Pin PCB TB 3.81]
R26  R_1206_32K  [RES 1206]
R27  R_1206_32K  [RES 1206]
R28  R_0603_100R  [RES 0603]
R29  R_0603_100R  [RES 0603]
R30  R_0603_100R  [RES 0603]
R31  R_0603_100R  [RES 0603]
R32  R_1206_32K  [RES 1206]
R33  R_1206_32K  [RES 1206]
R34  R_0603_100R  [RES 0603]
R35  R_0603_100R  [RES 0603]
R36  R_0603_100R  [RES 0603]
R37  R_0603_100R  [RES 0603]
R38  R_1206_32K  [RES 1206]
R39  R_0603_100R  [RES 0603]
R40  R_0603_100R  [RES 0603]
U5  U_SOIC8_DRV8871DDA  [SOIC8]
U6  U_SOIC8_DRV8871DDA  [SOIC8]
U7  U_SOIC8_DRV8871DDA  [SOIC8]
U8  U_SOIC8_DRV8871DDA  [SOIC8]
U9  U_SOIC8_DRV8871DDA  [SOIC8]

### Nets
GND: C32.2 C33.2 C34.2 C35.2 C36.2 C37.2 C38.2 C39.2 C40.2 C41.2 R26.1 R27.1 R32.1 R33.1 R38.1 U5.1(GND) U5.7(PGND) U5.9(PAD) U6.1(GND) U6.7(PGND) U6.9(PAD) U7.1(GND) U7.7(PGND) U7.9(PAD) U8.1(GND) U8.7(PGND) U8.9(PAD) U9.1(GND) U9.7(PGND) U9.9(PAD)
TIM1_1: R28.1
TIM1_2: R30.1
TIM1_3: R29.1
TIM1_4: R31.1
TIM2_1: R34.1
TIM2_2: R36.1
TIM2_3: R35.1
TIM2_4: R37.1
TIM3_1: R39.1
TIM3_2: R40.1
Vmotor: C32.1 C33.1 C34.1 C35.1 C36.1 C37.1 C38.1 C39.1 C40.1 C41.1 U5.5(VM) U6.5(VM) U7.5(VM) U8.5(VM) U9.5(VM)
NetJ2_1: J2.1 U5.8(OUT2)
NetJ2_2: J2.2 U5.6(OUT1)
NetJ3_1: J3.1 U6.8(OUT2)
NetJ3_2: J3.2 U6.6(OUT1)
NetJ8_1: J8.1 U7.8(OUT2)
NetJ8_2: J8.2 U7.6(OUT1)
NetJ9_1: J9.1 U8.8(OUT2)
NetJ9_2: J9.2 U8.6(OUT1)
NetJ10_1: J10.1 U9.8(OUT2)
NetJ10_2: J10.2 U9.6(OUT1)
NetR26_2: R26.2 U5.4(ILIM)
NetR27_2: R27.2 U6.4(ILIM)
NetR28_2: R28.2 U5.3(IN1)
NetR29_2: R29.2 U6.3(IN1)
NetR30_2: R30.2 U5.2(IN2)
NetR31_2: R31.2 U6.2(IN2)
NetR32_2: R32.2 U7.4(ILIM)
NetR33_2: R33.2 U8.4(ILIM)
NetR34_2: R34.2 U7.3(IN1)
NetR35_2: R35.2 U8.3(IN1)
NetR36_2: R36.2 U7.2(IN2)
NetR37_2: R37.2 U8.2(IN2)
NetR38_2: R38.2 U9.4(ILIM)
NetR39_2: R39.2 U9.3(IN1)
NetR40_2: R40.2 U9.2(IN2)

### Notes on the sheet
- Labels drawn without touching a wire or pin: B1

### Library data of the parts
C32 C33 C36 C37 C40 = Cap: Capacitor; Published: 8-Jun-2000; LatestRevisionDate: 17-Jul-2002; LatestRevisionNote: Re-released for DXP Platform.; Publisher: Altium Limited
C34 C35 C38 C39 C41 = Cap Tantalium: Capacitor Tantalium; Published: 8-Jun-2000; LatestRevisionDate: 17-Jul-2002; LatestRevisionNote: Re-released for DXP Platform.; Publisher: Altium Limited
J2 J3 J8-J10 = 2 Pin PCB Terminal Block: MF: CUI Devices; MP: TBP02R1-381-02BE; CUI_purchase_URL: https://www.cuidevices.com/product/interconnect/connectors/terminal-blocks/tbp02r1-381-series?utm_source=snapeda.com&utm_medium=referral&utm_campaign=snapedaBOM; Purchase-URL: https://pricing.snapeda.com/search/part/TBP02R1-381-02BE/?ref=eda; Price: None; SnapEDA_Link: https://www.snapeda.com/parts/TBP02R1-381-02BE/CUI+Devices/view-part/?ref=snap; Check_prices: https://www.snapeda.com/parts/TBP02R1-381-02BE/CUI+Devices/view-part/?ref=eda; Package: None; Availability: In Stock; Value: *
R26-R40 = Res: Resistor; Published: 8-Jun-2000; LatestRevisionDate: 17-Jul-2002; LatestRevisionNote: Re-released for DXP Platform.; Publisher: Altium Limited
U5-U9 = DRV8871DDA: 45-V, 3.6-A H-bridge motor driver with integrated current sensing 8-SO PowerPAD -40 to 125; MF: Texas Instruments; Mouser-Purchase-URL: https://snapeda.com/shop?store=Mouser&id=547750; SnapEDA_Link: https://www.snapeda.com/parts/DRV8871DDA/Texas%20Instruments/view-part/547750/?ref=snap; DigiKey-Purchase-URL: https://snapeda.com/shop?store=DigiKey&id=547750; Arrow_Electronics-Purchase-URL: https://snapeda.com/shop?store=Arrow+Electronics&id=547750; MP: DRV8871DDA; Texas_Instruments-Purchase-URL: https://snapeda.com/shop?store=Texas+Instruments&id=547750; Availability: Good; Price: None; Value: *; Package: HSOIC-8 Texas Instruments; BuyPart: https://www.snapeda.com/parts/DRV8871DDA/Texas%20Instruments/view-part/547750/?ref=eda

## Sheet Power.SchDoc
size A
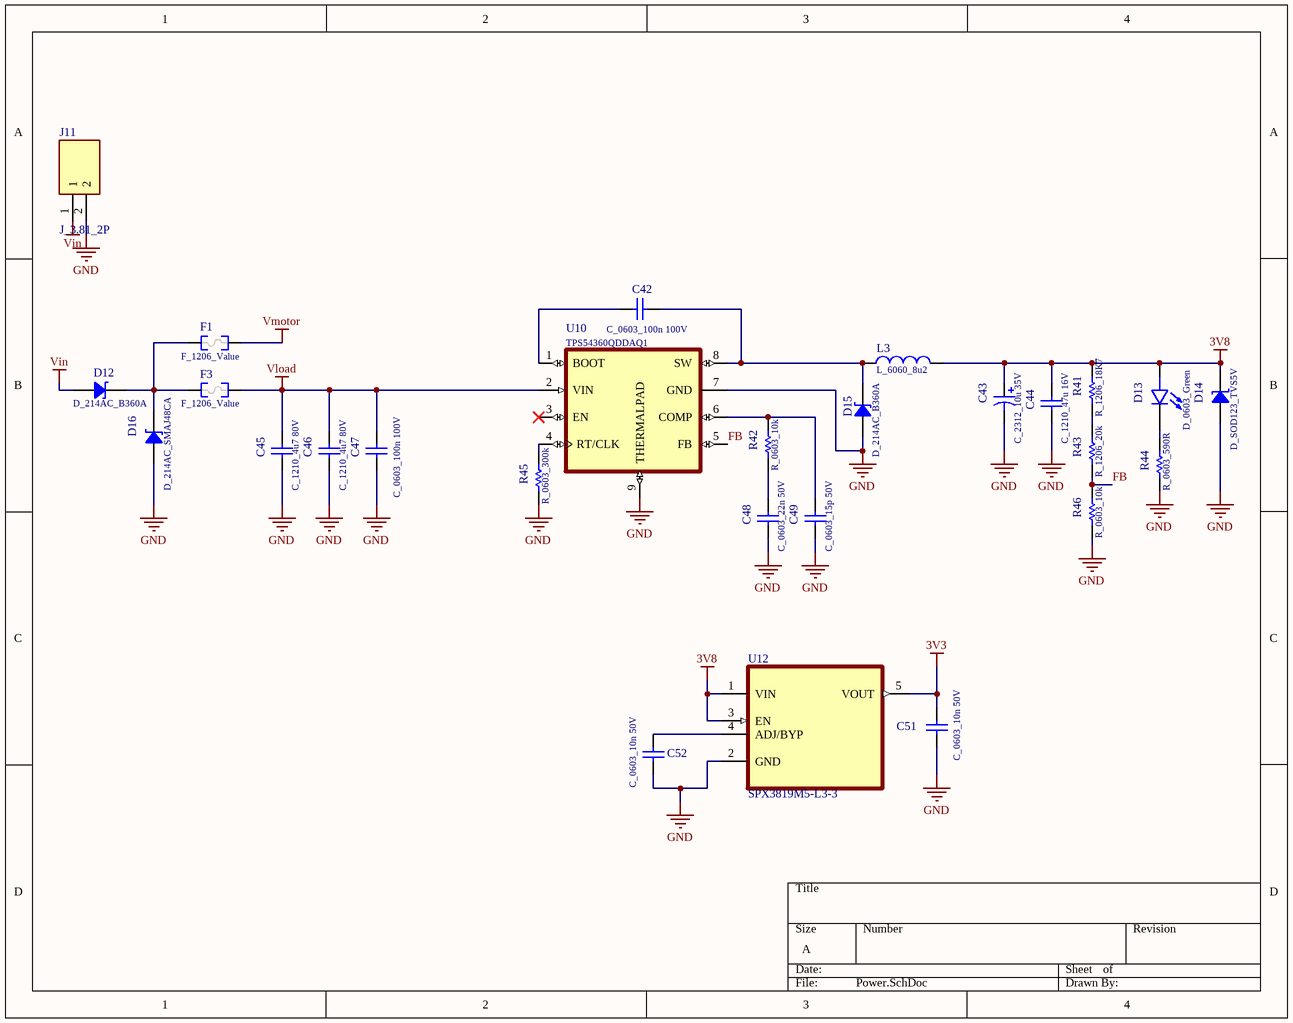
[diagram p5: Power.SchDoc]

### Parts
C42  C_0603_100n 100V  [CAP 0603]
C43  C_2312_10u 35V  [CAP 2312 TAN]
C44  C_1210_47u 16V  [CAP 1210]
C45  C_1210_4u7 80V  [CAP 1210]
C46  C_1210_4u7 80V  [CAP 1210]
C47  C_0603_100n 100V  [CAP 0603]
C48  C_0603_22n 50V  [CAP 0603]
C49  C_0603_15p 50V  [CAP 0603]
C51  C_0603_10n 50V  [CAP 0603]
C52  C_0603_10n 50V  [CAP 0603]
D12  D_214AC_B360A  [DO214AC SMA]
D13  D_0603_Green  [Led 0603]
D14  D_SOD123_TVS5V  [SOD-123]
D15  D_214AC_B360A  [DO214AC SMA]
D16  D_214AC_SMAJ48CA  [DO214AC SMA]
F1  F_1206_Value  [FUSE 1206_3216 0.6MM]
F3  F_1206_Value  [FUSE 1206_3216 0.6MM]
J11  J_3.81_2P  [2 Pin PCB TB 3.81]
L3  L_6060_8u2  [Inductor 6060]
R41  R_1206_18K7  [RES 1206]
R42  R_0603_10k  [RES 0603]
R43  R_1206_20k  [RES 1206]
R44  R_0603_590R  [RES 0603]
R45  R_0603_300k  [RES 0603]
R46  R_0603_10k  [RES 1206]
U10  TPS54360QDDAQ1  [SOIC8]
U12  SPX3819M5-L3-3  [SOT23-5]

### Nets
3V3: C51.2 U12.5(VOUT)
3V8: C43.1 C44.1 D13.1(A) D14.2 L3.2 R41.2 U12.1(VIN) U12.3(EN)
GND: C43.2 C44.2 C45.2 C46.2 C47.2 C48.2 C49.2 C51.1 C52.1 D14.1 D15.1 D16.1 J11.2 R44.1 R45.1 R46.1 U10.7(GND) U10.9(THERMALPAD) U12.2(GND)
Vin: D12.1 J11.1
Vload: C45.1 C46.1 C47.1 F3.2 U10.2(VIN)
Vmotor: F1.2
FB: R43.1 R46.2 U10.5(FB)
NetC42_1: C42.1 D15.2 L3.1 U10.8(SW)
NetC42_2: C42.2 U10.1(BOOT)
NetC48_1: C48.1 R42.1
NetC49_1: C49.1 R42.2 U10.6(COMP)
NetC52_2: C52.2 U12.4(ADJ/BYP)
NetD12_2: D12.2 D16.2 F1.1 F3.1
NetD13_2: D13.2(C) R44.2
NetR41_1: R41.1 R43.2
NetR45_2: R45.2 U10.4(RT/CLK)

Not connected (* = marked no-connect by the designer): U10 3(EN)*

### Library data of the parts
C42 C44-C49 C51 C52 = Cap: Capacitor; Published: 8-Jun-2000; LatestRevisionDate: 17-Jul-2002; LatestRevisionNote: Re-released for DXP Platform.; Publisher: Altium Limited
C43 = Cap Tantalium: Capacitor Tantalium; Published: 8-Jun-2000; LatestRevisionDate: 17-Jul-2002; LatestRevisionNote: Re-released for DXP Platform.; Publisher: Altium Limited
D12 D15 D16 = Diode Zener: Zener Diode
D13 = Led: MP: SML-D12FWT86; MF: Rohm; Price: None; Availability: In Stock; Package: 0603 Rohm; SnapEDA_Link: https://www.snapeda.com/parts/SML-D12FWT86/Rohm/view-part/?ref=snap; Check_prices: https://www.snapeda.com/parts/SML-D12FWT86/Rohm/view-part/?ref=eda; Value: *; Purchase-URL: https://pricing.snapeda.com/search/part/SML-D12FWT86/?ref=eda
D14 = DIODE TVS UNI: Rectifier Diode
F1 F3 = Fuse
J11 = 2 Pin PCB Terminal Block: MF: CUI Devices; MP: TBP02R1-381-02BE; CUI_purchase_URL: https://www.cuidevices.com/product/interconnect/connectors/terminal-blocks/tbp02r1-381-series?utm_source=snapeda.com&utm_medium=referral&utm_campaign=snapedaBOM; Purchase-URL: https://pricing.snapeda.com/search/part/TBP02R1-381-02BE/?ref=eda; Price: None; SnapEDA_Link: https://www.snapeda.com/parts/TBP02R1-381-02BE/CUI+Devices/view-part/?ref=snap; Check_prices: https://www.snapeda.com/parts/TBP02R1-381-02BE/CUI+Devices/view-part/?ref=eda; Package: None; Availability: In Stock; Value: *
L3 = Inductor: as L1 on sheet GSM; Published: 26-Sep-2008; DatasheetVersion: Mar-2008; PackageVersion: Mar-2008; PackageReference: B82462G4; Publisher: Altium Limited; PackageDescription: SM Power Inductor; 2 Leads; Body 6.3 x 6.3 x 3.0 mm (LxWxH); ComponentLink1Description: Manufacturer Link; ComponentLink1URL: http://www.epcos.com/; ComponentLink2Description: Datasheet; ComponentLink2URL: http://www.epcos.com/inf/30/db/ind_2008/b82462g4.pdf
R41-R46 = Res: Resistor; Published: 8-Jun-2000; LatestRevisionDate: 17-Jul-2002; LatestRevisionNote: Re-released for DXP Platform.; Publisher: Altium Limited
U12 = SPX3819M5-L: Linear Voltage Regulator IC 1 Output 500mA SOT-23-5; MP: SPX3819M5-L/TR; MF: MaxLinear, Inc.; Package: SOT-23-5 Exar; SnapEDA_Link: https://www.snapeda.com/parts/SPX3819M5-L/TR/MaxLinear,%20Inc./view-part/35772/?ref=snap; Digi-Key_Purchase_URL: https://www.digikey.com/product-detail/en/maxlinear-inc/SPX3819M5-L-TR/1016-1871-1-ND/3586588?utm_source=snapeda&utm_medium=aggregator&utm_campaign=symbol; Value: *; Digi-Key_Part_Number: 1016-1871-1-ND
U10 = TPS54360QDDAQ1: Package: None; Price: None; Value: *; MP: TPS54360QDDAQ1; Availability: Unavailable

## Sheet Sensor.SchDoc
size A
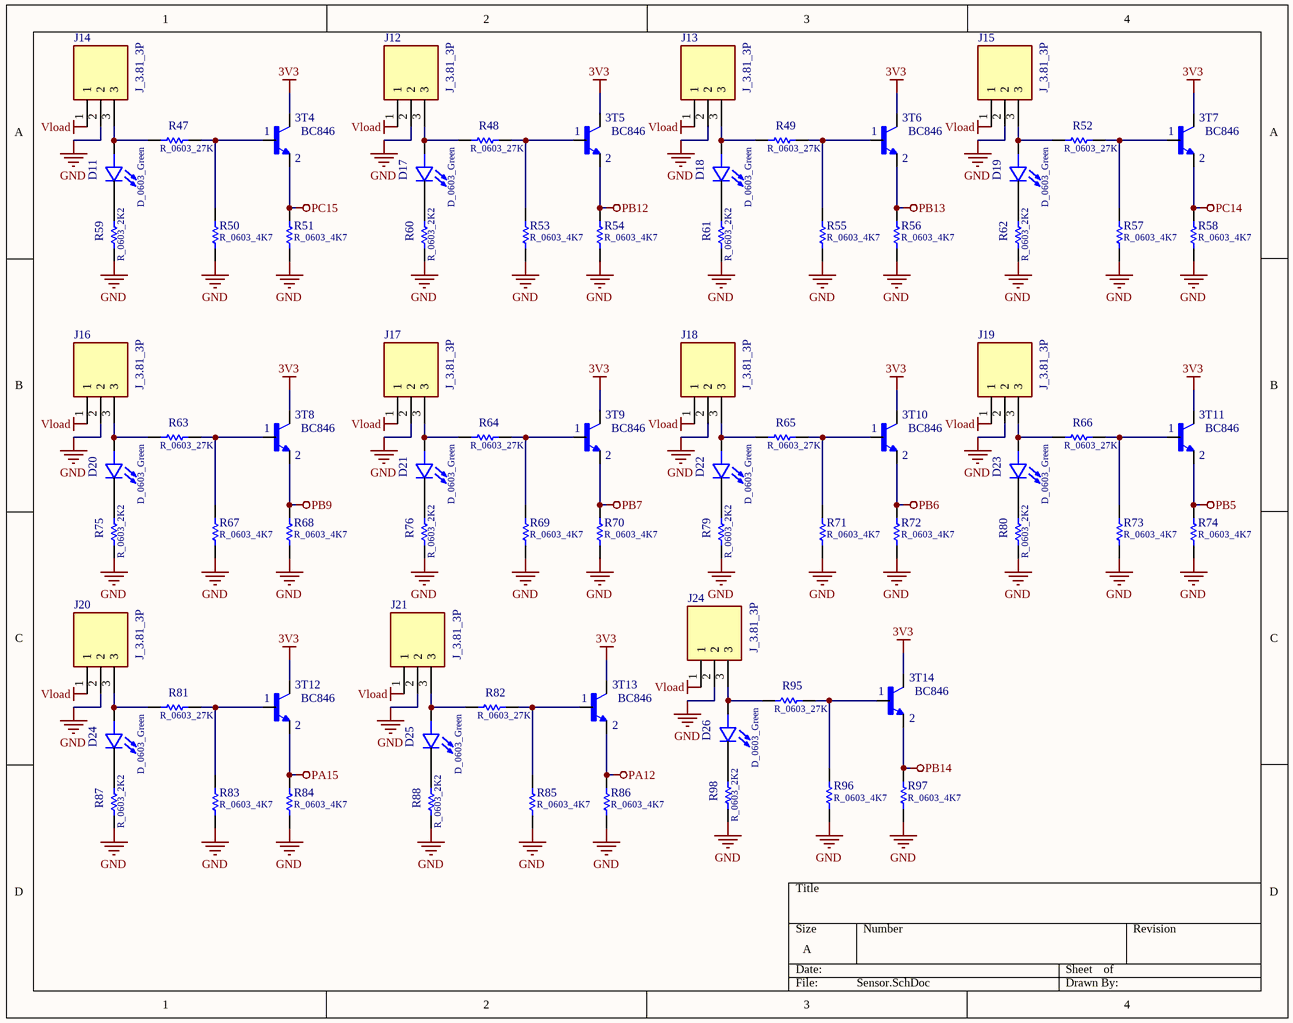
[diagram p6: Sensor.SchDoc]

### Parts
D11  D_0603_Green  [Led 0603]
D17  D_0603_Green  [Led 0603]
D18  D_0603_Green  [Led 0603]
D19  D_0603_Green  [Led 0603]
D20  D_0603_Green  [Led 0603]
D21  D_0603_Green  [Led 0603]
D22  D_0603_Green  [Led 0603]
D23  D_0603_Green  [Led 0603]
D24  D_0603_Green  [Led 0603]
D25  D_0603_Green  [Led 0603]
D26  D_0603_Green  [Led 0603]
J12  J_3.81_3P  [3 Pin PCB TB 3.81]
J13  J_3.81_3P  [3 Pin PCB TB 3.81]
J14  J_3.81_3P  [3 Pin PCB TB 3.81]
J15  J_3.81_3P  [3 Pin PCB TB 3.81]
J16  J_3.81_3P  [3 Pin PCB TB 3.81]
J17  J_3.81_3P  [3 Pin PCB TB 3.81]
J18  J_3.81_3P  [3 Pin PCB TB 3.81]
J19  J_3.81_3P  [3 Pin PCB TB 3.81]
J20  J_3.81_3P  [3 Pin PCB TB 3.81]
J21  J_3.81_3P  [3 Pin PCB TB 3.81]
J24  J_3.81_3P  [3 Pin PCB TB 3.81]
R47  R_0603_27K  [RES 0603]
R48  R_0603_27K  [RES 0603]
R49  R_0603_27K  [RES 0603]
R50  R_0603_4K7  [RES 0603]
R51  R_0603_4K7  [RES 0603]
R52  R_0603_27K  [RES 0603]
R53  R_0603_4K7  [RES 0603]
R54  R_0603_4K7  [RES 0603]
R55  R_0603_4K7  [RES 0603]
R56  R_0603_4K7  [RES 0603]
R57  R_0603_4K7  [RES 0603]
R58  R_0603_4K7  [RES 0603]
R59  R_0603_2K2  [RES 0603]
R60  R_0603_2K2  [RES 0603]
R61  R_0603_2K2  [RES 0603]
R62  R_0603_2K2  [RES 0603]
R63  R_0603_27K  [RES 0603]
R64  R_0603_27K  [RES 0603]
R65  R_0603_27K  [RES 0603]
R66  R_0603_27K  [RES 0603]
R67  R_0603_4K7  [RES 0603]
R68  R_0603_4K7  [RES 0603]
R69  R_0603_4K7  [RES 0603]
R70  R_0603_4K7  [RES 0603]
R71  R_0603_4K7  [RES 0603]
R72  R_0603_4K7  [RES 0603]
R73  R_0603_4K7  [RES 0603]
R74  R_0603_4K7  [RES 0603]
R75  R_0603_2K2  [RES 0603]
R76  R_0603_2K2  [RES 0603]
R79  R_0603_2K2  [RES 0603]
R80  R_0603_2K2  [RES 0603]
R81  R_0603_27K  [RES 0603]
R82  R_0603_27K  [RES 0603]
R83  R_0603_4K7  [RES 0603]
R84  R_0603_4K7  [RES 0603]
R85  R_0603_4K7  [RES 0603]
R86  R_0603_4K7  [RES 0603]
R87  R_0603_2K2  [RES 0603]
R88  R_0603_2K2  [RES 0603]
R95  R_0603_27K  [RES 0603]
R96  R_0603_4K7  [RES 0603]
R97  R_0603_4K7  [RES 0603]
R98  R_0603_2K2  [RES 0603]
T4  BC846  [SOT23]
T5  BC846  [SOT23]
T6  BC846  [SOT23]
T7  BC846  [SOT23]
T8  BC846  [SOT23]
T9  BC846  [SOT23]
T10  BC846  [SOT23]
T11  BC846  [SOT23]
T12  BC846  [SOT23]
T13  BC846  [SOT23]
T14  BC846  [SOT23]

### Nets
3V3: T4.3(C) T5.3(C) T6.3(C) T7.3(C) T8.3(C) T9.3(C) T10.3(C) T11.3(C) T12.3(C) T13.3(C) T14.3(C)
GND: J12.2 J13.2 J14.2 J15.2 J16.2 J17.2 J18.2 J19.2 J20.2 J21.2 J24.2 R50.1 R51.1 R53.1 R54.1 R55.1 R56.1 R57.1 R58.1 R59.1 R60.1 R61.1 R62.1 R67.1 R68.1 R69.1 R70.1 R71.1 R72.1 R73.1 R74.1 R75.1 R76.1 R79.1 R80.1 R83.1 R84.1 R85.1 R86.1 R87.1 R88.1 R96.1 R97.1 R98.1
PA12: R86.2 T13.2(E)
PA15: R84.2 T12.2(E)
PB5: R74.2 T11.2(E)
PB6: R72.2 T10.2(E)
PB7: R70.2 T9.2(E)
PB9: R68.2 T8.2(E)
PB12: R54.2 T5.2(E)
PB13: R56.2 T6.2(E)
PB14: R97.2 T14.2(E)
PC14: R58.2 T7.2(E)
PC15: R51.2 T4.2(E)
Vload: J12.1 J13.1 J14.1 J15.1 J16.1 J17.1 J18.1 J19.1 J20.1 J21.1 J24.1
NetD11_1: D11.1(A) J14.3 R47.2
NetD11_2: D11.2(C) R59.2
NetD17_1: D17.1(A) J12.3 R48.2
NetD17_2: D17.2(C) R60.2
NetD18_1: D18.1(A) J13.3 R49.2
NetD18_2: D18.2(C) R61.2
NetD19_1: D19.1(A) J15.3 R52.2
NetD19_2: D19.2(C) R62.2
NetD20_1: D20.1(A) J16.3 R63.2
NetD20_2: D20.2(C) R75.2
NetD21_1: D21.1(A) J17.3 R64.2
NetD21_2: D21.2(C) R76.2
NetD22_1: D22.1(A) J18.3 R65.2
NetD22_2: D22.2(C) R79.2
NetD23_1: D23.1(A) J19.3 R66.2
NetD23_2: D23.2(C) R80.2
NetD24_1: D24.1(A) J20.3 R81.2
NetD24_2: D24.2(C) R87.2
NetD25_1: D25.1(A) J21.3 R82.2
NetD25_2: D25.2(C) R88.2
NetD26_1: D26.1(A) J24.3 R95.2
NetD26_2: D26.2(C) R98.2
NetR47_1: R47.1 R50.2 T4.1(B)
NetR48_1: R48.1 R53.2 T5.1(B)
NetR49_1: R49.1 R55.2 T6.1(B)
NetR52_1: R52.1 R57.2 T7.1(B)
NetR63_1: R63.1 R67.2 T8.1(B)
NetR64_1: R64.1 R69.2 T9.1(B)
NetR65_1: R65.1 R71.2 T10.1(B)
NetR66_1: R66.1 R73.2 T11.1(B)
NetR81_1: R81.1 R83.2 T12.1(B)
NetR82_1: R82.1 R85.2 T13.1(B)
NetR95_1: R95.1 R96.2 T14.1(B)

### Library data of the parts
D11 D17-D26 = Led: MP: SML-D12FWT86; MF: Rohm; Price: None; Availability: In Stock; Package: 0603 Rohm; SnapEDA_Link: https://www.snapeda.com/parts/SML-D12FWT86/Rohm/view-part/?ref=snap; Check_prices: https://www.snapeda.com/parts/SML-D12FWT86/Rohm/view-part/?ref=eda; Value: *; Purchase-URL: https://pricing.snapeda.com/search/part/SML-D12FWT86/?ref=eda
J12-J21 J24 = 3 Pin PCB Terminal Block: MF: {'manufacturer': u'CUI'}; MP: TBP02R1-381-03BE; Price: None; Package: None; Value: *; Availability: Unavailable
R47-R76 R79-R88 R95-R98 = Res: Resistor; Published: 8-Jun-2000; LatestRevisionDate: 17-Jul-2002; LatestRevisionNote: Re-released for DXP Platform.; Publisher: Altium Limited
T4-T14 = BC846: as T1 on sheet GSM; MP: BC846; Value: *; SnapEDA_Link: https://www.snapeda.com/parts/BC846/Onsemi/view-part/?ref=snap; Availability: In Stock; Purchase-URL: https://pricing.snapeda.com/search/part/BC846/?ref=eda; Package: SOT-23-3 Panasonic Electronic; Price: None; Check_prices: https://www.snapeda.com/parts/BC846/Onsemi/view-part/?ref=eda

## Nets that join several sheets
3V3: Com (C5.2 J1.1 U1.16), ESP (6 pins), MCU (18 pins), Power (C51.2 U12.5), Sensor (11 pins)
3V8: GSM (D6.2 L1.2 R11.2), Power (8 pins)
GND: Com (5 pins), ESP (27 pins), GSM (87 pins), MCU (27 pins), Motor (30 pins), Power (19 pins), Sensor (44 pins)
PA12: MCU (U4.46), Sensor (R86.2 T13.2)
PA15: MCU (U4.51), Sensor (R84.2 T12.2)
PB5: MCU (U4.58), Sensor (R74.2 T11.2)
PB6: MCU (U4.59), Sensor (R72.2 T10.2)
PB7: MCU (U4.60), Sensor (R70.2 T9.2)
PB9: MCU (U4.62), Sensor (R68.2 T8.2)
PB12: MCU (U4.34), Sensor (R54.2 T5.2)
PB13: MCU (U4.35), Sensor (R56.2 T6.2)
PB14: MCU (U4.36), Sensor (R97.2 T14.2)
PC14: MCU (U4.3), Sensor (R58.2 T7.2)
PC15: MCU (U4.4), Sensor (R51.2 T4.2)
TIM1_1: MCU (U4.8), Motor (R28.1)
TIM1_2: MCU (U4.9), Motor (R30.1)
TIM1_3: MCU (U4.10), Motor (R29.1)
TIM1_4: MCU (U4.11), Motor (R31.1)
TIM2_1: MCU (U4.12), Motor (R34.1)
TIM2_2: MCU (U4.13), Motor (R36.1)
TIM2_3: MCU (U4.14), Motor (R35.1)
TIM2_4: MCU (U4.17), Motor (R37.1)
TIM3_1: MCU (U4.20), Motor (R39.1)
TIM3_2: MCU (U4.21), Motor (R40.1)
UART4_RX: GSM (R9.2), MCU (U4.53)
UART4_TX: GSM (R10.2), MCU (U4.52)
UART5_RX: ESP (R77.1 U2.12), MCU (R100.1)
UART5_TX: ESP (R78.1 U2.11), MCU (R99.1)
USART2_RX: Com (R94.2 U1.12), MCU (R102.2)
USART2_TX: Com (R93.2 U1.11), MCU (R101.2)
Vload: MCU (J22.1 J23.1), Power (5 pins), Sensor (11 pins)
Vmotor: Motor (15 pins), Power (F1.2)